# EAGLE schematic what-the-frequency-mk-2 (EAGLE 6.4)
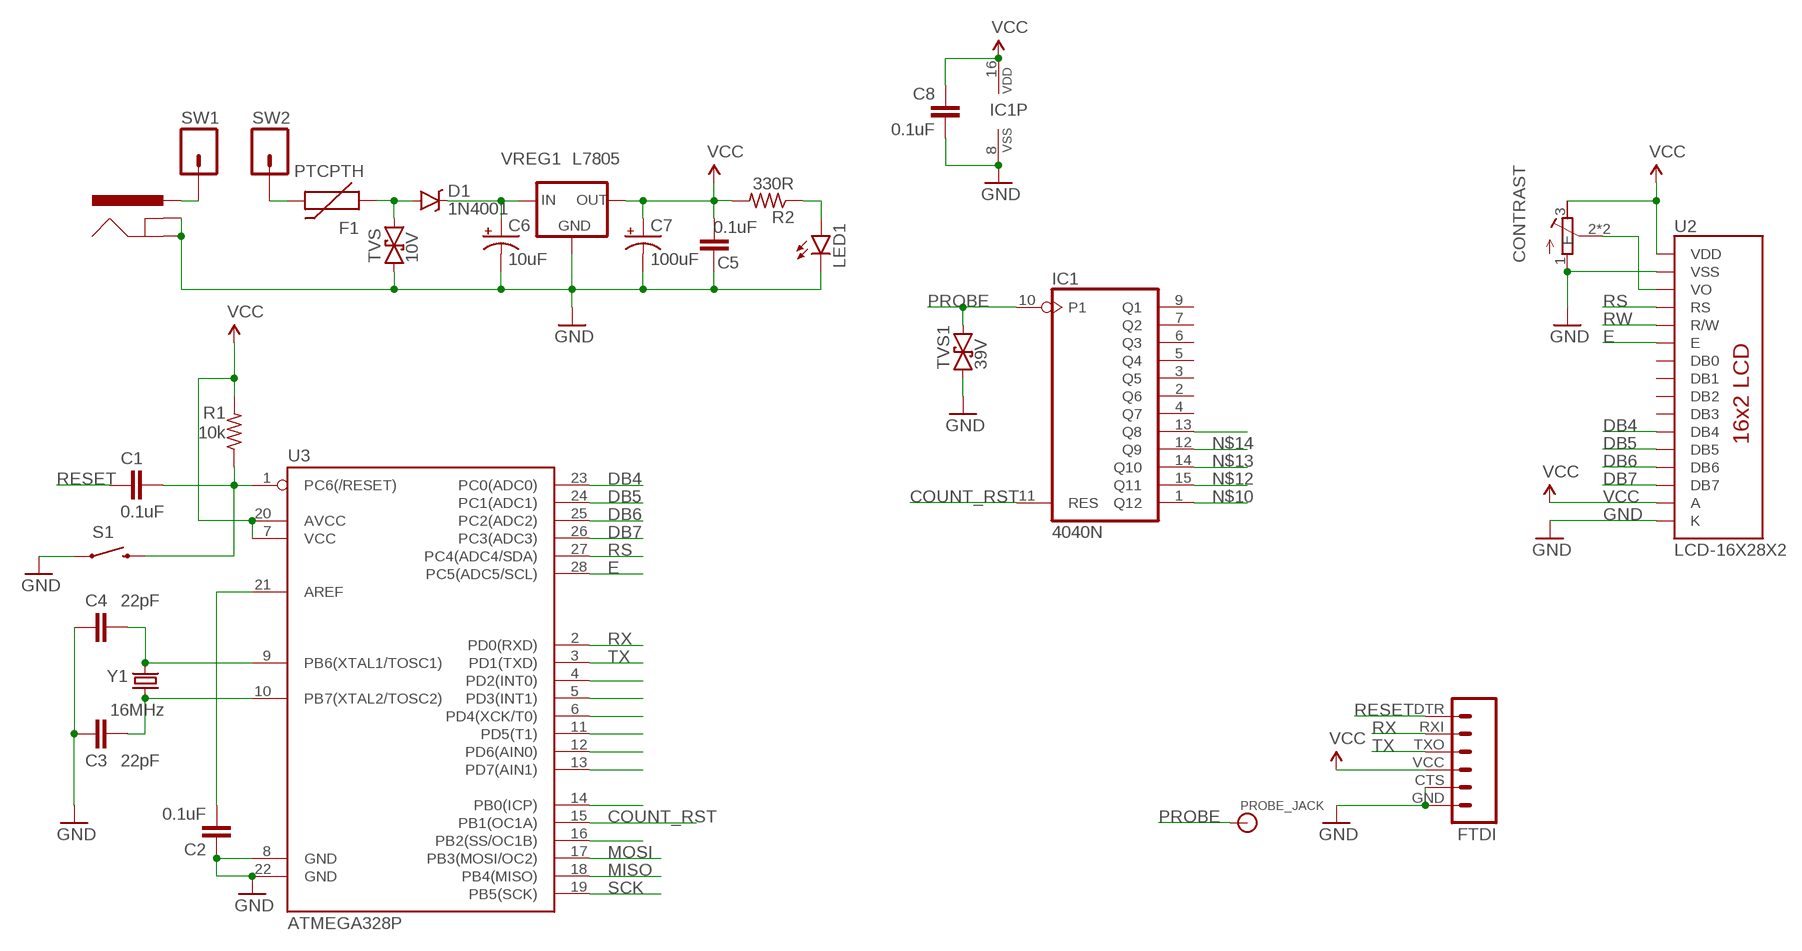
[diagram p0: schematic, sheet 1]

## Parts
C1  0.1uF  CAPACITOR-CERAMIC025-024X044  [C025-024X044]
C2  0.1uF  CAPACITOR-CERAMIC025-024X044  [C025-024X044]
C3  22pF  CAPACITOR-CERAMIC025-024X044  [C025-024X044]
C4  22pF  CAPACITOR-CERAMIC025-024X044  [C025-024X044]
C5  0.1uF  CAPACITOR-CERAMIC025-024X044  [C025-024X044]
C6  10uF  CAPACITOR-POLARIZEDE2.5-5  [E2,5-5]
C7  100uF  CAPACITOR-POLARIZEDE2.5-5  [E2,5-5]
C8  0.1uF  CAPACITOR-CERAMIC025-024X044  [C025-024X044]
CONTRAST  POTENTIOMETERTHUMBWHEEL-16MM  [POT-THUMBWHEEL]
D1  1N4001  DIODE-SCHOTTKYDO-41  [DO-41]
F1  PTCPTH  [PTC]
FTDI  FTDI_BASICPTH-TINY-TEXT  [FTDI_TINY_TXT]
IC1  4040N  [DIL16]
J1  POWER_JACKPTH  [POWER_JACK_PTH]
LED1  LED3MM  [LED3MM]
PROBE_JACK  BANANA_CONNPTH-RA  [BANANA-PTH-RA-SAFEWORD]
R1  10k  RESISTORPTH-AXIAL-5.08MM  [AXIAL-PTH-5.08MM]
R2  330R  RESISTORPTH-AXIAL-5.08MM  [AXIAL-PTH-5.08MM]
S1  SWITCH-MOMENTARY-2PTH-RA  [TACTILE-PTH-SIDE]
SW1  M01PTH_2MM  [1X01_2MM]
SW2  M01PTH_2MM  [1X01_2MM]
TVS  10V  TVSDO-41-TVS-BIDIRECTIONAL  [DO-41-TVS]
TVS1  39V  TVSDO-41-TVS-BIDIRECTIONAL  [DO-41-TVS]
U2  LCD-16X28X2  [LCD-8X2]
U3  ATMEGA328P  ATMEGA328P_PDIP  [DIL28-3]
VREG1  L7805  V_REG_78XXTO-92-INLINE  [TO-92-AMMO]
Y1  16MHz  CRYSTALHC49UV  [HC49U-V]

## Nets
COUNT_RST: IC1.11(RES) U3.15(PB1(OC1A))
DB4: U2.11(DB4) U3.23(PC0(ADC0))
DB5: U2.12(DB5) U3.24(PC1(ADC1))
DB6: U2.13(DB6) U3.25(PC2(ADC2))
DB7: U2.14(DB7) U3.26(PC3(ADC3))
E: U2.6(E) U3.28(PC5(ADC5/SCL))
GND: C2.1 C3.2 C4.2 C5.1 C6.- C7.- C8.1 CONTRAST.1(A) FTDI.CTS FTDI.GND IC1.8(VSS) J1.GND J1.GNDBREAK LED1.K(C) S1.1 TVS1.P$1 TVS.P$1 U2.1(VSS) U2.16(K) U3.8(GND) U3.22(GND) VREG1.2(GND)
MISO: U3.18(PB4(MISO))
MOSI: U3.17(PB3(MOSI/OC2))
N$1: C6.+ D1.C VREG1.1(IN)
N$2: LED1.A R2.P$1
N$3: J1.PWR SW1.1
N$4: D1.A F1.P$1 TVS.P$2
N$5: F1.P$2 SW2.1
N$6: C4.1 U3.9(PB6(XTAL1/TOSC1)) Y1.2
N$7: C3.1 U3.10(PB7(XTAL2/TOSC2)) Y1.1
N$8: C2.2 U3.21(AREF)
N$9: CONTRAST.2(S) CONTRAST.2@1(S) U2.3(VO)
N$10: IC1.1(Q12)
N$11: C1.2 R1.P$1 S1.2 U3.1(PC6(/RESET))
N$12: IC1.15(Q11)
N$13: IC1.14(Q10)
N$14: IC1.12(Q9)
N$15: IC1.13(Q8)
N$22: U3.4(PD2(INT0))
N$23: U3.5(PD3(INT1))
N$24: U3.6(PD4(XCK/T0))
N$25: U3.11(PD5(T1))
N$26: U3.12(PD6(AIN0))
N$27: U3.13(PD7(AIN1))
N$28: U3.14(PB0(ICP))
N$29: U3.16(PB2(SS/OC1B))
PROBE: IC1.10(P1) PROBE_JACK.P$1 PROBE_JACK.P$2 TVS1.P$2
RESET: C1.1 FTDI.DTR
RS: U2.4(RS) U3.27(PC4(ADC4/SDA))
RW: U2.5(R/W)
RX: FTDI.RXI U3.2(PD0(RXD))
SCK: U3.19(PB5(SCK))
TX: FTDI.TXO U3.3(PD1(TXD))
VCC: C5.2 C7.+ C8.2 CONTRAST.3(E) FTDI.VCC IC1.16(VDD) R1.P$2 R2.P$2 U2.2(VDD) U2.15(A) U3.7(VCC) U3.20(AVCC) VREG1.3(OUT)
Unconnected: IC1.2(Q6) IC1.3(Q5) IC1.4(Q7) IC1.5(Q4) IC1.6(Q3) IC1.7(Q2) IC1.9(Q1) U2.7(DB0) U2.8(DB1) U2.9(DB2) U2.10(DB3)

## Library data of the parts
C1-C5 C8 = A_butts:CAPACITOR-CERAMIC: CAPACITOR, European symbol
C6 C7 = A_butts:CAPACITOR-POLARIZED: POLARIZED CAPACITOR, American symbol
CONTRAST = A_butts:POTENTIOMETER: Trimm resistor
D1 = A_butts:DIODE-SCHOTTKY: Schottky diodes in SFE's production catalog BAT20J 1A 23V 0.62Vf RB751 120mA 40V 0.37Vf PMEG4005EJ 0.5A 40V 0.42Vf MBRA140 1A 40V 0.5Vf B340A 3A 40V SMA
F1 = A_butts:PTC: Resettable Fuse PTC Resettable Fuse. Spark Fun Electronics SKU : COM-08357
FTDI = A_butts:FTDI_BASIC: FTDI Basic header with labels
IC1 = A_butts:4040: 12-stage binary/ripple COUNTER
J1 = SparkFun-Connectors:POWER_JACK: Power Jack This is the standard 5.5mm barrel jack for power. The PTH is the most common, proven, reliable, footprint. The Slot footprint only works if the mill layer is transmitted to the PCB fab house so be warned. Mating wall wart : TOL-00298 (and others); PROD_ID: PRT-00119
LED1 = A_butts:LED: LEDs Standard schematic elements and footprints for 5mm, 3mm, 1206, and 0603 sized LEDs. 5mm - Spark Fun Electronics SKU : COM-00529 (and others)
PROBE_JACK = A_butts:BANANA_CONN: Through-hole banana jack
R1 R2 = A_butts:RESISTOR: RESISTOR, American symbol
S1 = A_butts:SWITCH-MOMENTARY-2: Various NO switches- pushbuttons, reed, etc
SW1 SW2 = A_butts:M01: Header 1 Standard 1-pin 0.1" header. Use with straight break away headers (SKU : PRT-00116), right angle break away headers (PRT-00553), swiss pins (PRT-00743), machine pins (PRT-00117), and female headers (PRT-00115).
TVS TVS1 = A_butts:TVS: Transient voltage suppressor- prevents ESD on inputs. Ignore package description- MBRA140 is NOT this type of part!!!
U2 = A_butts:LCD-16X2: Standard text-only 16x2 parallel input LCD
U3 = SparkFun-DigitalIC:ATMEGA328P_PDIP: uC used in the Arduino 32kb flash, 1k EEPROM, 2k SRAM This is the through-hole version of this chip.
VREG1 = A_butts:V_REG_78XX: Voltage Regulator Standard 7805 5V regulator. IGO (Input Ground Output). Spark Fun Electronics SKU : COM-00107
Y1 = SparkFun-FreqCtrl:CRYSTAL: Various standard crystals. Proven footprints. Spark Fun Electronics SKU : COM-00534